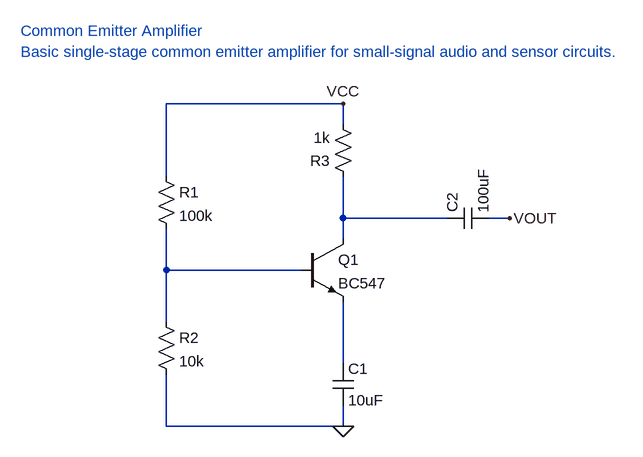
[diagram p0: schematic common_emitter_amplifier.asc]
common_emitter_amplifier.asc, the LTspice schematic file:
Version 4
SHEET 1 1200 800
TEXT 16 16 Left 2 ;Common Emitter Amplifier
TEXT 16 48 Left 2 ;Basic single-stage common emitter amplifier for small-signal audio and sensor circuits.
SYMBOL npn 448 336 R0
SYMATTR InstName Q1
SYMATTR Value BC547
SYMBOL res 224 224 R0
SYMATTR InstName R1
SYMATTR Value 100k
SYMBOL res 224 448 R0
SYMATTR InstName R2
SYMATTR Value 10k
SYMBOL res 528 256 R180
SYMATTR InstName R3
SYMATTR Value 1k
SYMBOL cap 496 528 R0
SYMATTR InstName C1
SYMATTR Value 10uF
SYMBOL cap 672 320 R270
SYMATTR InstName C2
SYMATTR Value 100uF
FLAG 512 128 VCC
WIRE 240 128 240 208
WIRE 240 128 512 128
WIRE 240 208 240 240
WIRE 512 128 512 160
WIRE 240 320 240 352
WIRE 240 352 240 384
WIRE 240 384 240 432
WIRE 240 384 416 384
WIRE 240 432 240 464
WIRE 416 384 448 384
FLAG 512 624 0
WIRE 240 544 240 576
WIRE 240 576 240 624
WIRE 240 624 512 624
WIRE 512 592 512 624
WIRE 512 240 512 272
WIRE 512 272 512 304
WIRE 512 304 512 336
WIRE 512 304 640 304
WIRE 640 304 672 304
WIRE 512 432 512 464
WIRE 512 464 512 496
WIRE 512 496 512 528
FLAG 768 304 VOUT
WIRE 736 304 768 304

The netlist it stands for:
* common_emitter_amplifier.asc
Q1 N002 N001 N003 0 BC547
R1 VCC N001 100k
R2 N001 0 10k
R3 N002 VCC 1k
C1 N003 0 10uF
C2 N002 VOUT 100uF
.model NPN NPN
.model PNP PNP
.lib standard.bjt
* Common Emitter Amplifier
* Basic single-stage common emitter amplifier for small-signal audio and sensor circuits.
.backanno
.end